# EasyEDA schematic SCH_supercap_2024-08-12.json
TITLE: Sheet_1; REV: 1.0; Date: 2024-08-10; Sheet: 1/1; Company: broke
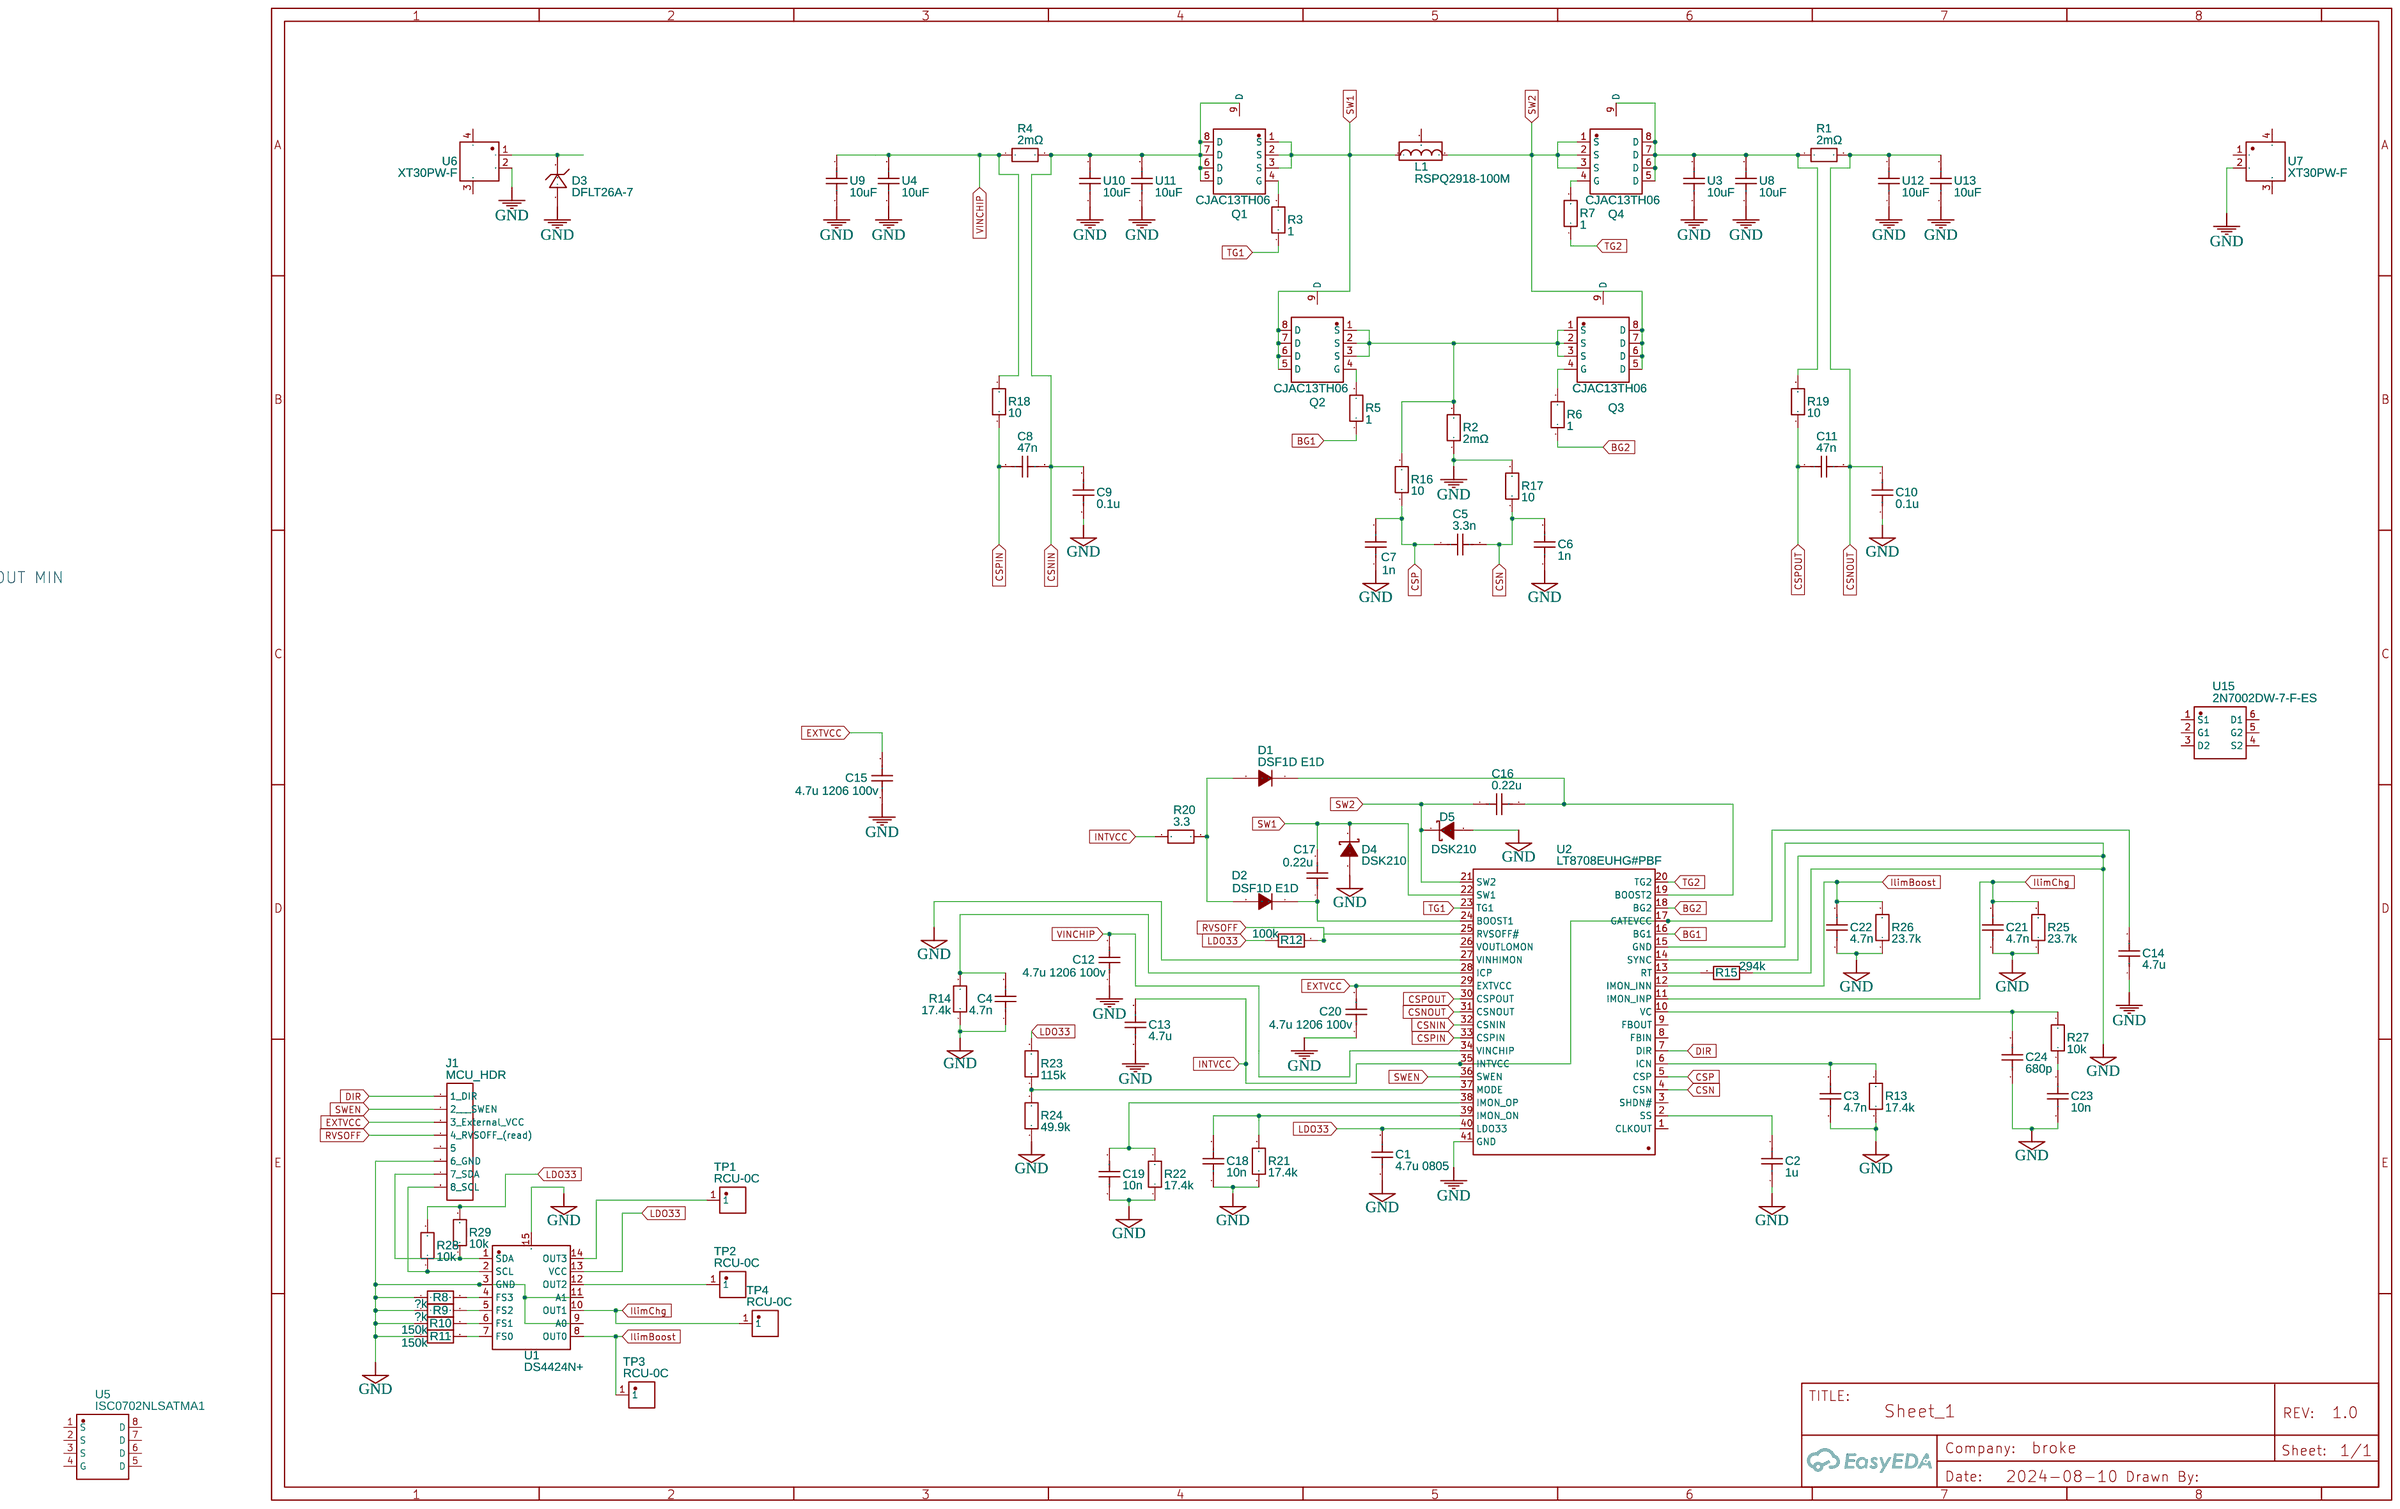
[diagram p0: schematic sheet]

## Parts
C1  4.7u 0805  [C0805]
C2  1u  [C0603]
C3  4.7n  [C0603]
C4  4.7n  [C0603]
C5  3.3n  [C0603]
C6  1n  [C0603]
C7  1n  [C0603]
C8  47n  [C0603]
C9  0.1u  [C0603]
C10  0.1u  [C0603]
C11  47n  [C0603]
C12  4.7u 1206 100v  [C1206]
C13  4.7u  [C0603]
C14  4.7u  [C0603]
C15  4.7u 1206 100v  [C1206]
C16  0.22u  [C0603]
C17  0.22u  [C0603]
C18  10n  [C0603]
C19  10n  [C0603]
C20  4.7u 1206 100v  [C1206]
C21  4.7n  [C0603]
C22  4.7n  [C0603]
C23  10n  [C0603]
C24  680p  [C0603]
D1  DSF1D E1D  [SOD-123_L2.8-W1.8-LS3.7-RD]
D2  DSF1D E1D  [SOD-123_L2.8-W1.8-LS3.7-RD]
D3  DFLT26A-7  [POWERDI-123_L2.8-W1.8-LS3.7-RD]
D4  DSK210  [SOD-123FL_L2.7-W1.8-LS3.8-RD]
D5  DSK210  [SOD-123FL_L2.7-W1.8-LS3.8-RD]
J1  MCU_HDR  [HDR-M-2.54_1X8]
L1  RSPQ2918-100M  [IND-SMD_3P-L27.9-W19.7-P10.43-LS27.9-BL-A]
Q1  CJAC13TH06  [PDFN-8_L5.8-W4.9-P1.27-LS6.1-BL]
Q2  CJAC13TH06  [PDFN-8_L5.8-W4.9-P1.27-LS6.1-BL]
Q3  CJAC13TH06  [PDFN-8_L5.8-W4.9-P1.27-LS6.1-BL]
Q4  CJAC13TH06  [PDFN-8_L5.8-W4.9-P1.27-LS6.1-BL]
R1  2mΩ  [R1225]
R2  2mΩ  [R1225]
R3  1  [R0603]
R4  2mΩ  [R1225]
R5  1  [R0603]
R6  1  [R0603]
R7  1  [R0603]
R8  ?k  [R0603]
R9  ?k  [R0603]
R10  150k  [R0603]
R11  150k  [R0603]
R12  100k  [R0603]
R13  17.4k  [R0603]
R14  17.4k  [R0603]
R15  294k  [R0603]
R16  10  [R0603]
R17  10  [R0603]
R18  10  [R0603]
R19  10  [R0603]
R20  3.3  [R0603]
R21  17.4k  [R0603]
R22  17.4k  [R0603]
R23  115k  [R0603]
R24  49.9k  [R0603]
R25  23.7k  [R0603]
R26  23.7k  [R0603]
R27  10k  [R0603]
R28  10k  [R0603]
R29  10k  [R0603]
TP1  RCU-0C  [TESTPOINT-SMD_L1.6-W0.8_RCU-0C]
TP2  RCU-0C  [TESTPOINT-SMD_L1.6-W0.8_RCU-0C]
TP3  RCU-0C  [TESTPOINT-SMD_L1.6-W0.8_RCU-0C]
TP4  RCU-0C  [TESTPOINT-SMD_L1.6-W0.8_RCU-0C]
U1  DS4424N+  [TDFN-14_L3.0-W3.0-P0.40-BL-EP]
U2  LT8708EUHG#PBF  [QFN-40_L8.0-W5.0-P0.50-TL-EP_ADI_UHG]
U3  10uF  [C2220]
U4  10uF  [C2220]
U5  ISC0702NLSATMA1  [PG-TDSON-8_L5.9-W5.1-P1.27-LS6.1-BL]
U6  XT30PW-F  [CONN-TH_XT30PW-F-1]
U7  XT30PW-F  [CONN-TH_XT30PW-F-1]
U8  10uF  [C2220]
U9  10uF  [C2220]
U10  10uF  [C2220]
U11  10uF  [C2220]
U12  10uF  [C2220]
U13  10uF  [C2220]
U15  2N7002DW-7-F-ES  [SOT-363_L2.1-W1.3-P0.65-LS2.3-BL]

## Library data of the parts
C1 = C_0805_US: Contributor: LCEDA_Lib
C2-C11 C13 C14 C16-C19 C21-C24 = C_0603_US: Contributor: LCEDA_Lib
C12 C15 C20 = C_0805_US: Contributor: LCEDA_Lib; Package Display: No
D1 D2 = DSF1D E1D: Supplier: LCSC; Manufacturer: MDD(辰达半导体); Supplier Part: C64909; JLCPCB Part Class: Extended Part; link: https://lcsc.com/eda_search?q=C64909&%26type=1&ref=editor
D3 = DFLT26A-7: Contributor: LCSC; Supplier: LCSC; Supplier Part: C531178; Manufacturer: DIODES(美台); JLCPCB Part Class: Extended Part; link: https://lcsc.com/eda_search?q=C531178&%26type=1&ref=editor
D4 D5 = DSK210: Contributor: LCSC; Supplier: LCSC; Supplier Part: C541662; Manufacturer: AnBon(安邦); JLCPCB Part Class: Extended Part; link: https://lcsc.com/eda_search?q=C541662&%26type=1&ref=editor
J1 = HDR-M-2.54_1x8: Supplier Part: C190820; Supplier: LCSC; Contributor: LCEDA_Lib
L1 = RSPQ2918-100M: Supplier: LCSC; Supplier Part: C32712982; Manufacturer: Ruishen(瑞申电子); Contributor: lcsc; link: https://lcsc.com/eda_search?q=C32712982&%26type=1&ref=editor
Q1-Q4 = CJAC13TH06: Contributor: LCSC; Supplier: LCSC; Supplier Part: C504082; Manufacturer: CJ(江苏长电/长晶); JLCPCB Part Class: Extended Part; link: https://lcsc.com/eda_search?q=C504082&%26type=1&ref=editor
R1 R2 R4 = FCSL64R002GER: Contributor: LCSC; Supplier: LCSC; Supplier Part: C2484639; Manufacturer: Ohmite; JLCPCB Part Class: Extended Part; link: https://lcsc.com/eda_search?q=C2484639&%26type=1&ref=editor
R3 R5-R29 = R_0603_EU: Contributor: LCEDA_Lib
TP1-TP4 = RCU-0C: Contributor: lcsc; Supplier: LCSC; Supplier Part: C9900019498; Manufacturer: null; JLCPCB Part Class: Extended Part; link: https://lcsc.com/eda_search?q=C9900019498&%26type=1&ref=editor
U1 = DS4424N+: Contributor: LCSC; Supplier: LCSC; Supplier Part: C1555241; Manufacturer: ADI(亚德诺)/MAXIM(美信); JLCPCB Part Class: Extended Part; link: https://lcsc.com/eda_search?q=C1555241&%26type=1&ref=editor
U2 = LT8708EUHG#PBF: Contributor: lcsc; Supplier: LCSC; Supplier Part: C1530024; Manufacturer: ADI(亚德诺); JLCPCB Part Class: Extended Part; link: https://lcsc.com/eda_search?q=C1530024&%26type=1&ref=editor
U3 U4 U8-U13 = CKG57NX7R1H106M500JH: Contributor: lcsc; Supplier: LCSC; Supplier Part: C3843063; Manufacturer: TDK; link: https://lcsc.com/eda_search?q=C3843063&%26type=1&ref=editor
U5 = ISC0702NLSATMA1: Contributor: lcsc; Supplier: LCSC; Supplier Part: C3278628; Manufacturer: Infineon(英飞凌); JLCPCB Part Class: Extended Part; link: https://lcsc.com/eda_search?q=C3278628&%26type=1&ref=editor
U6 U7 = XT30PW-F: Contributor: LCSC; Supplier: LCSC; Supplier Part: C2913282; Manufacturer: AMASS(艾迈斯); Manufacturer Part: XT30PW-F20.G.Y; JLCPCB Part Class: Extended Part; link: https://lcsc.com/eda_search?q=C2913282&%26type=1&ref=editor
U15 = 2N7002DW-7-F-ES: Contributor: lcsc; Supplier: LCSC; Supplier Part: C5224252; Manufacturer: ElecSuper(静芯微); JLCPCB Part Class: Extended Part; link: https://lcsc.com/eda_search?q=C5224252&%26type=1&ref=editor

## Nets
GND: C1.1 C2.1 C3.1 C4.1 C6.1 C7.1 C9.1 C10.1 C12.1 C13.1 C14.1 C15.1 C18.1 C19.1 C20.1 C21.1 C22.1 C23.1 C24.1 D3.2(A) D4.2(A) D5.2(A) J1.6(6 GND) R2.1 R8.1 R9.1 R10.1 R11.1 R13.1 R14.1 R15.1 R17.2 R21.1 R22.1 R24.1 R25.1 R26.1 U1.3(GND) U1.9(A0) U1.11(A1) U1.15(EP) U2.14(SYNC) U2.15(GND) U2.27(VINHIMON) U2.41(GND) U3.1 U4.1 U6.2 U7.2 U8.1 U9.1 U10.1 U11.1 U12.1 U13.1
VINCHIP: C12.2 R4.1 R18.2 U2.34(VINCHIP) U4.2 U9.2
BG1: R5.1 U2.16(BG1)
BG2: R6.1 U2.18(BG2)
CSN: C5.2 C6.2 R17.1 U2.4(CSN)
CSNIN: C8.2 C9.2 Q1.5(D) Q1.6(D) Q1.7(D) Q1.8(D) R4.2 U2.32(CSNIN) U10.2 U11.2
CSNOUT: C10.2 C11.2 R1.2 U2.31(CSNOUT) U12.2 U13.2
CSP: C5.1 C7.2 R16.1 U2.5(CSP)
CSPIN: C8.1 R18.1 U2.33(CSPIN)
CSPOUT: C11.1 R19.1 U2.30(CSPOUT)
DIR: J1.1(1 DIR) U2.7(DIR)
EXTVCC: C15.2 C20.2 J1.3(3 External VCC) U2.29(EXTVCC)
IlimBoost: C22.2 R26.2 TP3.1 U1.8(OUT0) U2.12(IMON_INN)
IlimChg: C21.2 R25.2 TP4.1 U1.10(OUT1) U2.11(IMON_INP)
INTVCC: C13.2 C14.2 R20.1 U2.17(GATEVCC) U2.35(INTVCC)
LDO33: C1.2 R12.1 R23.2 R28.2 R29.2 U1.13(VCC) U2.40(LDO33)
RVSOFF: J1.4(4 RVSOFF (read)) R12.2 U2.25(RVSOFF#)
SW1: C17.2 D4.1(C) L1.1 Q1.1(S) Q1.2(S) Q1.3(S) Q2.5(D) Q2.6(D) Q2.7(D) Q2.8(D) U2.22(SW1)
SW2: C16.1 D5.1(C) L1.2 Q3.5(D) Q3.6(D) Q3.7(D) Q3.8(D) Q4.1(S) Q4.2(S) Q4.3(S) U2.21(SW2)
SWEN: J1.2(2   SWEN) U2.36(SWEN)
TG1: R3.1 U2.23(TG1)
TG2: R7.1 U2.20(TG2)
Net-(C2-2): C2.2 U2.2(SS)
Net-(C3-2): C3.2 R13.2 U2.6(ICN)
Net-(C4-2): C4.2 R14.2 U2.28(ICP)
Net-(C16-2): C16.2 D1.1 U2.19(BOOST2)
Net-(C17-1): C17.1 D2.1 U2.24(BOOST1)
Net-(C18-2): C18.2 R21.2 U2.39(IMON_ON)
Net-(C19-2): C19.2 R22.2 U2.38(IMON_OP)
Net-(C23-2): C23.2 R27.1
Net-(C24-2): C24.2 R27.2 U2.10(VC)
Net-(D1-2): D1.2 D2.2 R20.2
Net-(D3-1): D3.1(C) U6.1
Net-(J1-7): J1.7(7 SDA) R29.1 U1.1(SDA)
Net-(J1-8): J1.8(8 SCL) R28.1 U1.2(SCL)
Net-(Q1-4): Q1.4(G) R3.2
Net-(Q2-1): Q2.1(S) Q2.2(S) Q2.3(S) Q3.1(S) Q3.2(S) Q3.3(S) R2.2 R16.2
Net-(Q2-4): Q2.4(G) R5.2
Net-(Q3-4): Q3.4(G) R6.2
Net-(Q4-4): Q4.4(G) R7.2
Net-(Q4-5): Q4.5(D) Q4.6(D) Q4.7(D) Q4.8(D) R1.1 R19.2 U3.2 U8.2
Net-(R8-2): R8.2 U1.4(FS3)
Net-(R9-2): R9.2 U1.5(FS2)
Net-(R10-2): R10.2 U1.6(FS1)
Net-(R11-2): R11.2 U1.7(FS0)
Net-(R15-2): R15.2 U2.13(RT)
Net-(R23-1): R23.1 R24.2 U2.37(MODE)
Net-(TP1-1): TP1.1 U1.14(OUT3)
Net-(TP2-1): TP2.1 U1.12(OUT2)

Not connected (* = marked no-connect by the designer): J1 5; L1 3(NC); Q1 9(D); Q2 9(D); Q3 9(D); Q4 9(D); U2 1(CLKOUT) 3(SHDN#) 8(FBIN) 9(FBOUT) 26(VOUTLOMON); U5 1(S) 2(S) 3(S) 4(G) 5(D) 6(D) 7(D) 8(D); U6 3 4; U7 1 3 4; U15 1(S1) 2(G1) 3(D2) 4(S2) 5(G2) 6(D1)

## Notes on the sheet
- adj VOUT MAX/VOUT MIN
